# Altium schematic sheet MyBus.SchDoc
size A4
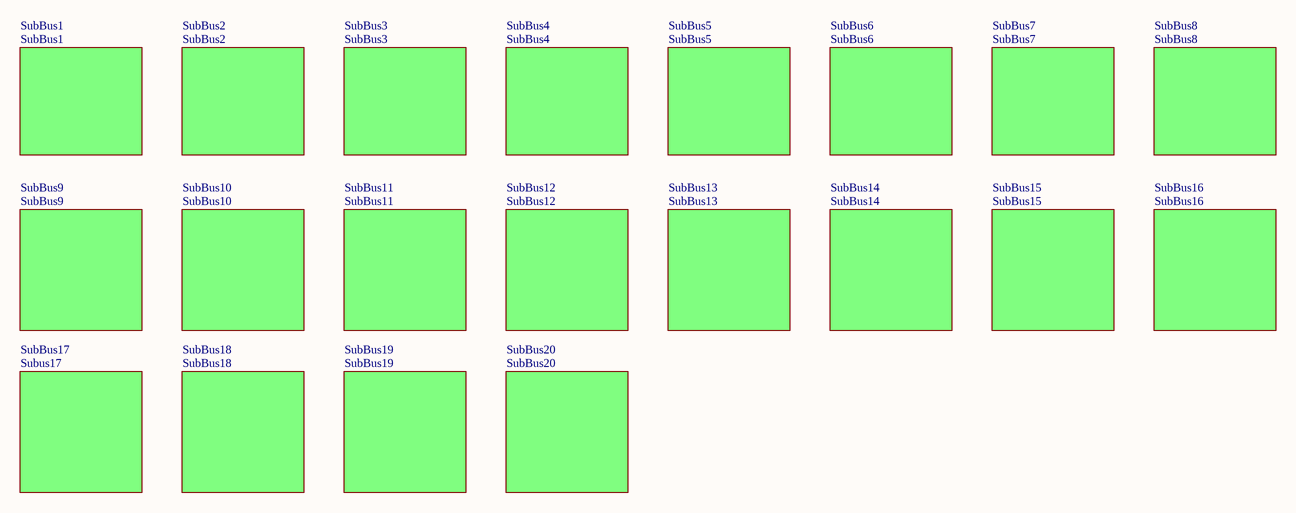
[diagram p0: MyBus.SchDoc]

## Sub-sheets
SubBus1 = SubBus1: no entries
SubBus2 = SubBus2: no entries
SubBus3 = SubBus3: no entries
SubBus4 = SubBus4: no entries
SubBus5 = SubBus5: no entries
SubBus6 = SubBus6: no entries
SubBus7 = SubBus7: no entries
SubBus8 = SubBus8: no entries
SubBus9 = SubBus9: no entries
SubBus10 = SubBus10: no entries
SubBus11 = SubBus11: no entries
SubBus12 = SubBus12: no entries
SubBus13 = SubBus13: no entries
SubBus14 = SubBus14: no entries
SubBus15 = SubBus15: no entries
SubBus16 = SubBus16: no entries
SubBus17 = Subus17: no entries
SubBus18 = SubBus18: no entries
SubBus19 = SubBus19: no entries
SubBus20 = SubBus20: no entries